# EAGLE schematic MOSFET_Board (EAGLE 9.3.0)

## Sheet 1 of 4
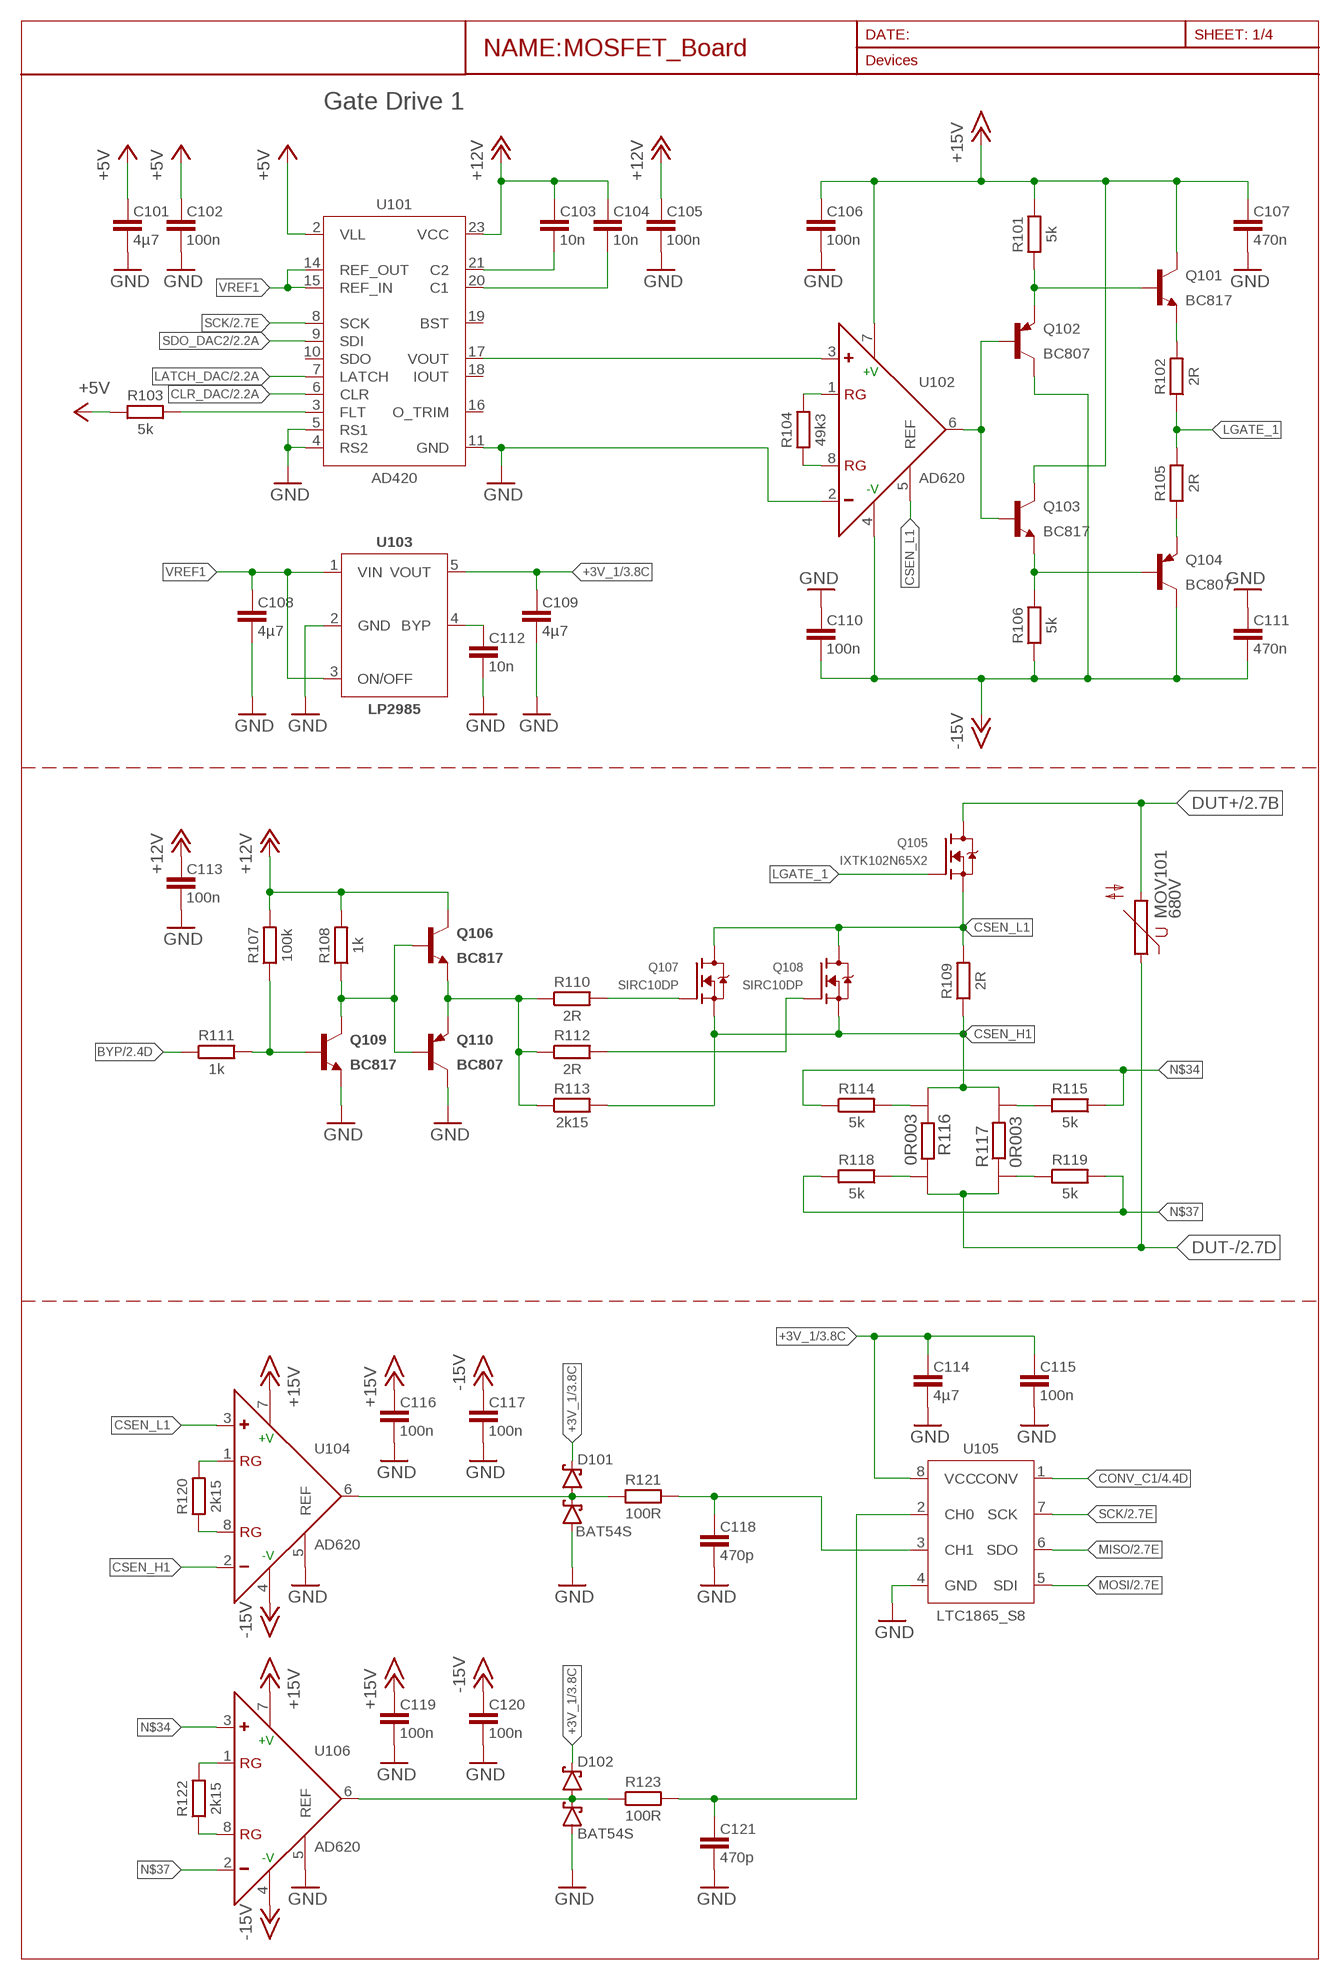
[diagram p0: schematic, sheet 1]

### Parts
C101  4µ7  CAP-3216  [CAPC3216X135]
C102  100n  CAP-1608  [CAPC1508X45]
C103  10n  CAP-1608  [CAPC1508X45]
C104  10n  CAP-1608  [CAPC1508X45]
C105  100n  CAP-1608  [CAPC1508X45]
C106  100n  CAP-1608  [CAPC1508X45]
C107  470n  CAP-1608  [CAPC1508X45]
C108  4µ7  CAP-3216  [CAPC3216X135]
C109  4µ7  CAP-3216  [CAPC3216X135]
C110  100n  CAP-1608  [CAPC1508X45]
C111  470n  CAP-1608  [CAPC1508X45]
C112  10n  CAP-1608  [CAPC1508X45]
C113  100n  CAP-1608  [CAPC1508X45]
C114  4µ7  CAP-3216  [CAPC3216X135]
C115  100n  CAP-1608  [CAPC1508X45]
C116  100n  CAP-1608  [CAPC1508X45]
C117  100n  CAP-1608  [CAPC1508X45]
C118  470p  CAP-1608  [CAPC1508X45]
C119  100n  CAP-1608  [CAPC1508X45]
C120  100n  CAP-1608  [CAPC1508X45]
C121  470p  CAP-1608  [CAPC1508X45]
D101  BAT54S  [SOT95P230X110-3]
D102  BAT54S  [SOT95P230X110-3]
MOV101  680V  MOV-14X7.4  [S14K680]
Q101  BC817  [SOT95P240X110-3]
Q102  BC807  [SOT95P240X110-3]
Q103  BC817  [SOT95P240X110-3]
Q104  BC807  [SOT95P240X110-3]
Q105  IXTK102N65X2  [TO-264P-V]
Q106  BC817  [SOT95P240X110-3]
Q107  SIRC10DP  [POWERPAK-SO-8]
Q108  SIRC10DP  [POWERPAK-SO-8]
Q109  BC817  [SOT95P240X110-3]
Q110  BC807  [SOT95P240X110-3]
R101  5k  R-EU-1608  [RESC1608X70]
R102  2R  R-EU-3216  [RESC3216X71]
R103  5k  R-EU-1608  [RESC1608X70]
R104  49k3  R-EU-1608  [RESC1608X70]
R105  2R  R-EU-3216  [RESC3216X71]
R106  5k  R-EU-1608  [RESC1608X70]
R107  100k  R-EU-1608  [RESC1608X70]
R108  1k  R-EU-1608  [RESC1608X70]
R109  2R  R-EU-3216  [RESC3216X71]
R110  2R  R-EU-3216  [RESC3216X71]
R111  1k  R-EU-1608  [RESC1608X70]
R112  2R  R-EU-3216  [RESC3216X71]
R113  2k15  R-EU-2012  [RESC2012X65]
R114  5k  R-EU-1608  [RESC1608X70]
R115  5k  R-EU-1608  [RESC1608X70]
R116  0R003  WSL3637_0.01  [WSL3637_0.01]
R117  0R003  WSL3637_0.01  [WSL3637_0.01]
R118  5k  R-EU-1608  [RESC1608X70]
R119  5k  R-EU-1608  [RESC1608X70]
R120  2k15  R-EU-2012  [RESC2012X65]
R121  100R  R-EU-1608  [RESC1608X70]
R122  2k15  R-EU-2012  [RESC2012X65]
R123  100R  R-EU-1608  [RESC1608X70]
U101  AD420  AD420AR  [SOIC127P1032X265-24]
U102  AD620  AD620R-8  [SOIC127P599X175-8]
U103  LP2985  [SOT95P280X145-5]
U104  AD620  AD620R-8  [SOIC127P599X175-8]
U105  LTC1865_S8  [SOIC127P599X175-8]
U106  AD620  AD620R-8  [SOIC127P599X175-8]

### Nets
+3V_1: C109.1 C114.1 C115.1 D101.2(C2) D102.2(C2) U103.5(VOUT) U105.8(VCC) ; also sheet 3
+5V: C101.1 C102.1 R103.2 U101.2(VLL) ; also sheet 2,3,4
+12V: C103.1 C104.1 C105.1 C113.1 Q106.3(C) R107.2 R108.2 U101.23(VCC) ; also sheet 2,3
+15V: C106.1 C107.1 C116.1 C119.1 Q101.3(C) Q103.3(C) R101.2 U102.7(+V) U104.7(+V) U106.7(+V) ; also sheet 2,3
-15V: C110.2 C111.2 C117.1 C120.1 Q102.3(C) Q104.3(C) R106.1 U102.4(-V) U104.4(-V) U106.4(-V) ; also sheet 2,3
BPY1G1: Q107.4(G) R110.2
BYP: R111.1 ; also sheet 2,4
BYP1: Q106.2(E) Q110.2(E) R110.1 R112.1 R113.1
BYP1G2: Q108.4(G) R112.2
CLR_DAC: U101.6(CLR) ; also sheet 2,4
CONV_C1: U105.1(CONV) ; also sheet 4
CSEN_H1: Q107.1(S) Q107.2(S) Q107.3(S) Q108.1(S) Q108.2(S) Q108.3(S) R109.1 R113.2 R116.I1 R117.I2 U104.2(-)
CSEN_L1: Q105.3(S) Q107.5(D) Q107.6(D) Q107.7(D) Q107.8(D) Q108.5(D) Q108.6(D) Q108.7(D) Q108.8(D) R109.2 U102.5(REF) U104.3(+)
DUT+ [DUT+]: MOV101.2 Q105.2(D) ; also sheet 2
DUT- [DUT-]: MOV101.1 R116.I2 R117.I1 ; also sheet 2,3
GND: C101.2 C102.2 C105.2 C106.2 C107.2 C108.2 C109.2 C110.1 C111.1 C112.2 C113.2 C114.2 C115.2 C116.2 C117.2 C118.2 C119.2 C120.2 C121.2 D101.1(A1) D102.1(A1) Q109.2(E) Q110.3(C) U101.4(RS2) U101.5(RS1) U101.11(GND) U102.2(-) U103.2(GND) U104.5(REF) U105.4(GND) U106.5(REF) ; also sheet 2,3,4
HIGHC1: C121.1 R123.2 U105.2(CH0)
LATCH_DAC: U101.7(LATCH) ; also sheet 2,4
LGATE_1: Q105.1(G) R102.1 R105.2
LOWC1: C118.1 R121.2 U105.3(CH1)
MISO: U105.6(SDO) ; also sheet 2,3,4
MOSI: U105.5(SDI) ; also sheet 2,3,4
N$1: Q101.1(B) Q102.2(E) R101.1
N$2: R104.2 U102.1(RG)
N$3: C103.2 U101.21(C2)
N$4: C104.2 U101.20(C1)
N$5: Q106.1(B) Q109.3(C) Q110.1(B) R108.1
N$6: R104.1 U102.8(RG)
N$7: D102.3(C1A2) R123.1 U106.6(OUT)
N$8: Q109.1(B) R107.1 R111.2
N$9: U101.17(VOUT) U102.3(+)
N$10: C112.1 U103.4(BYP)
N$11: Q104.2(E) R105.1
N$13: Q101.2(E) R102.2
N$16: D101.3(C1A2) R121.1 U104.6(OUT)
N$32: R115.2 R117.E2
N$34: R114.1 R115.1 U106.3(+)
N$35 [DUT-]: R116.E2 R118.1
N$37: R118.2 R119.2 U106.2(-)
N$38: R117.E1 R119.1
N$40: R114.2 R116.E1
N$60: R103.1 U101.3(FLT)
N$67: Q102.1(B) Q103.1(B) U102.6(OUT)
N$68: Q103.2(E) Q104.1(B) R106.2
RG1_L3: R122.2 U106.1(RG)
RG1_L4: R120.2 U104.1(RG)
RG2_L3: R122.1 U106.8(RG)
RG2_L4: R120.1 U104.8(RG)
SCK: U101.8(SCK) U105.7(SCK) ; also sheet 2,3,4
SDO_DAC2: U101.9(SDI) ; also sheet 2
VREF1: C108.1 U101.14(REF_OUT) U101.15(REF_IN) U103.1(VIN) U103.3(ON/OFF)
Unconnected: U101.10(SDO) U101.16(O_TRIM) U101.18(IOUT) U101.19(BST)

### Notes on the sheet
- Gate Drive 1

## Sheet 2 of 4
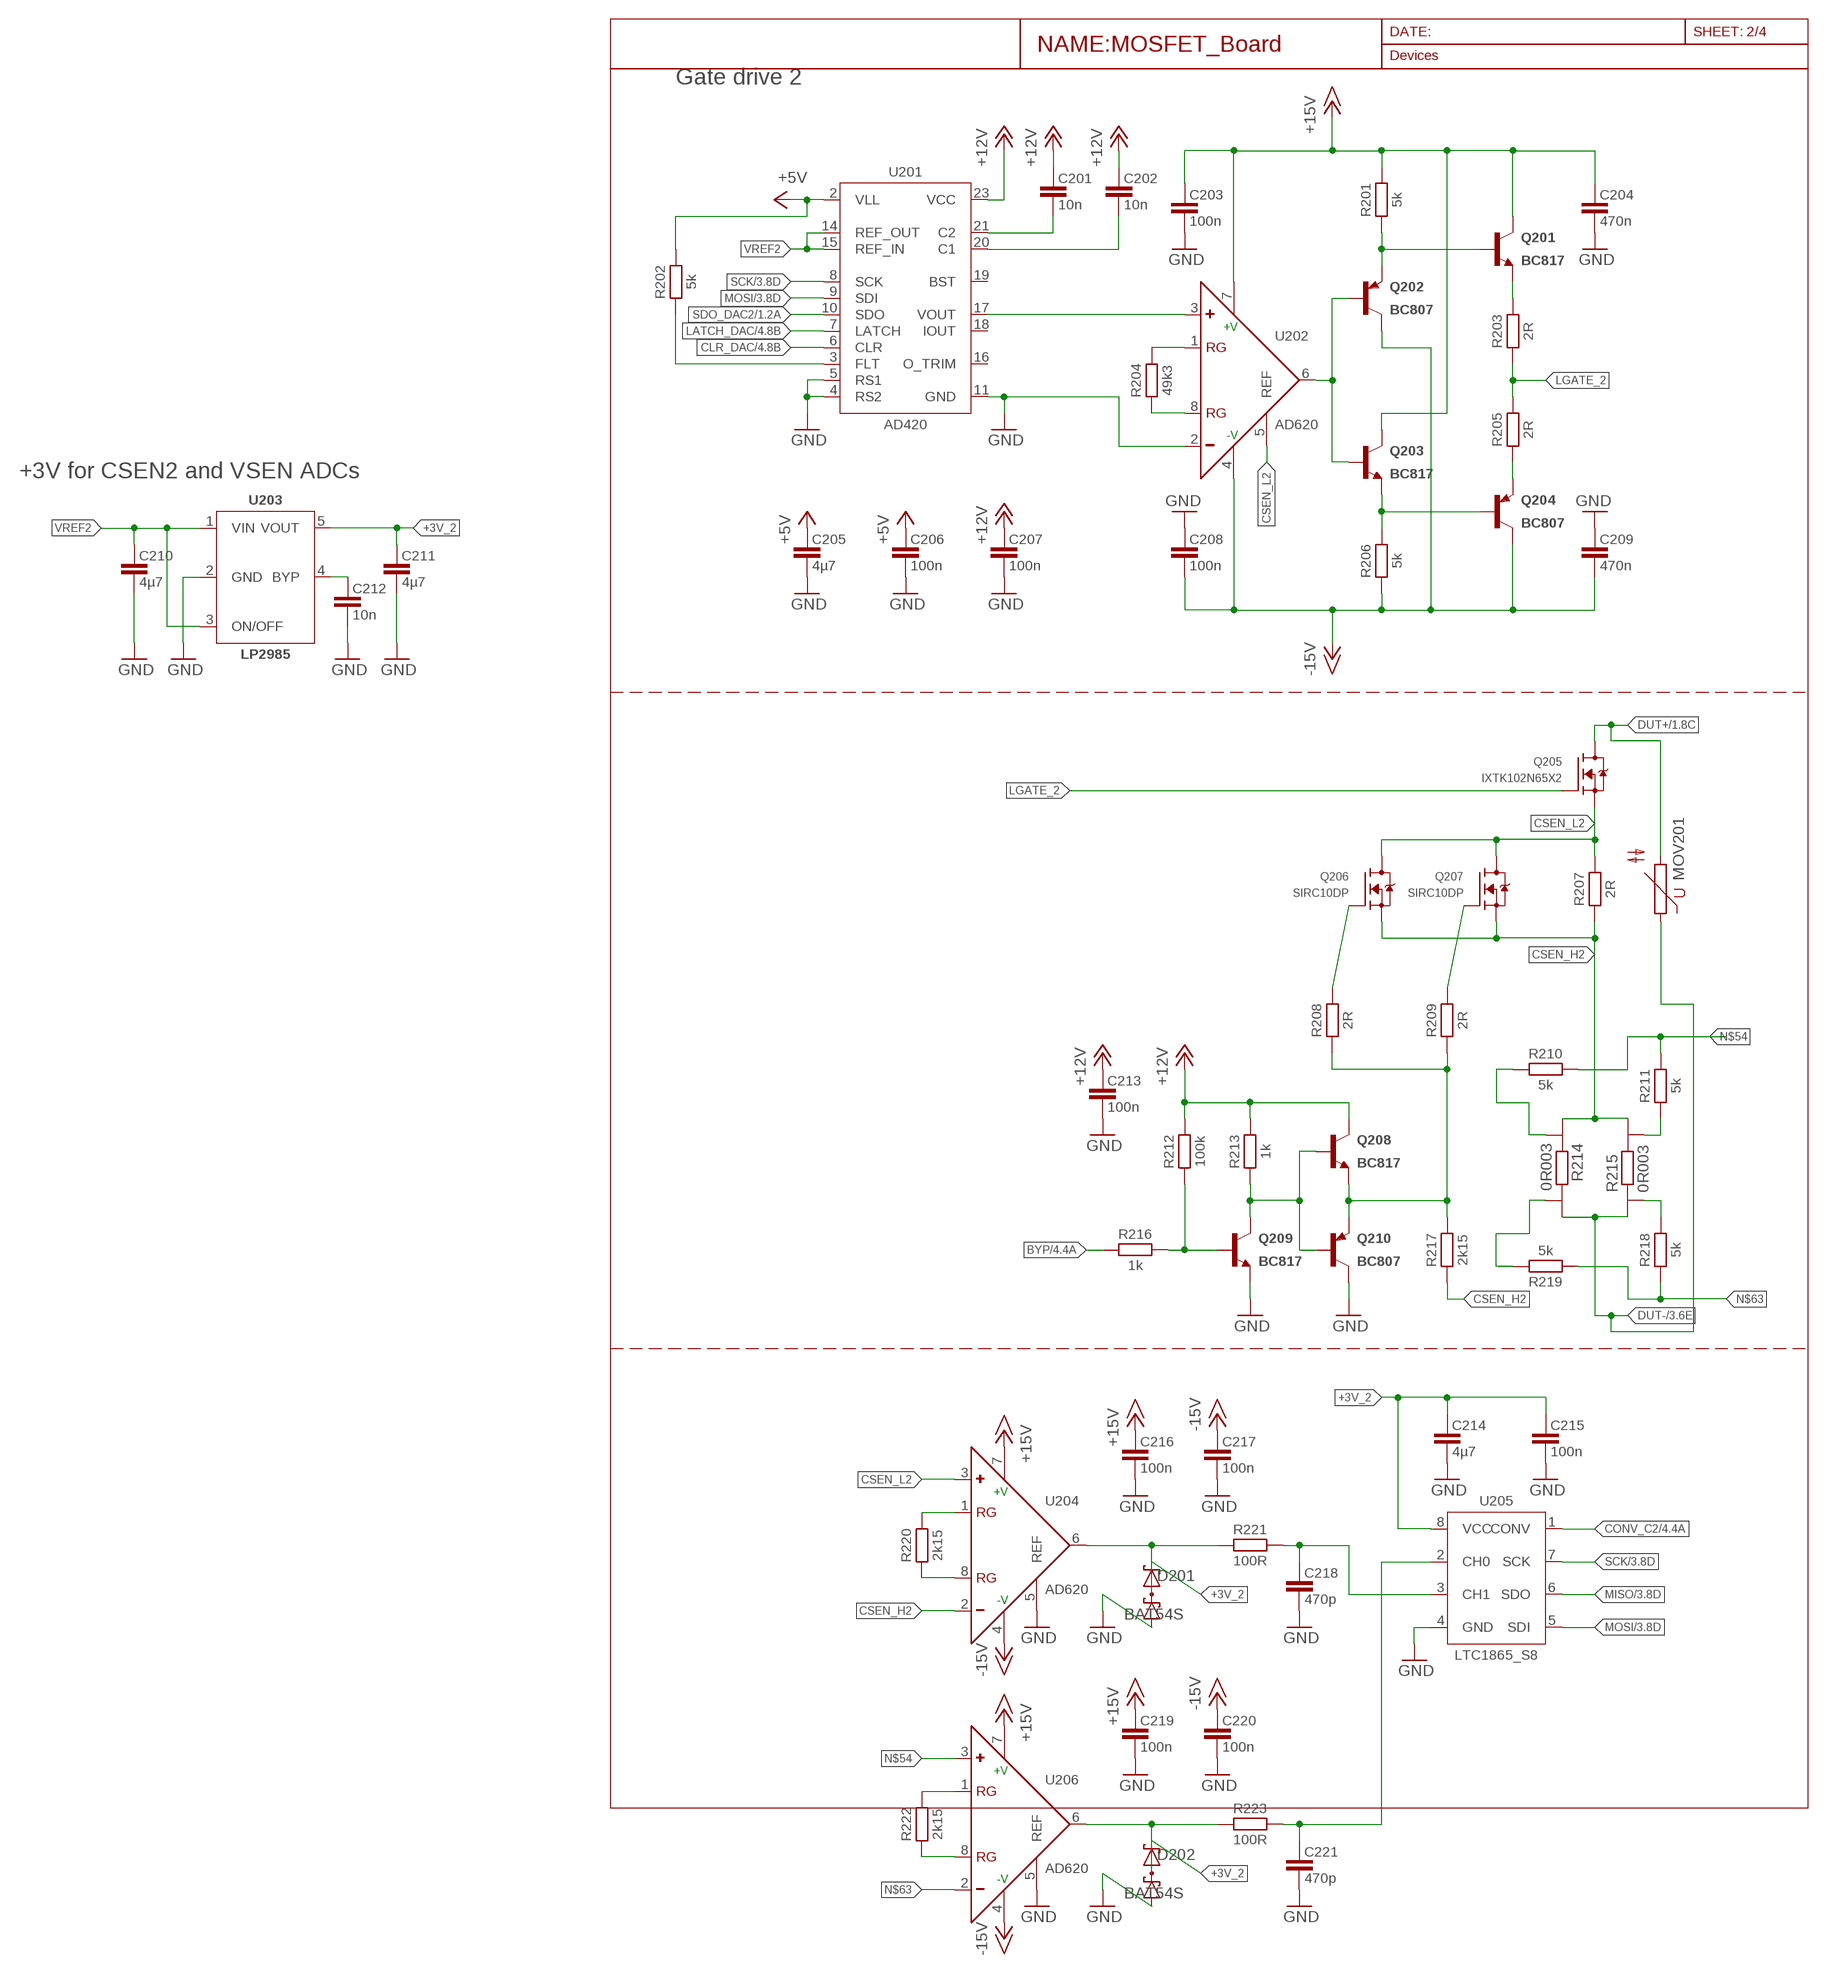
[diagram p1: schematic, sheet 2]

### Parts
C201  10n  CAP-1608  [CAPC1508X45]
C202  10n  CAP-1608  [CAPC1508X45]
C203  100n  CAP-1608  [CAPC1508X45]
C204  470n  CAP-1608  [CAPC1508X45]
C205  4µ7  CAP-3216  [CAPC3216X135]
C206  100n  CAP-1608  [CAPC1508X45]
C207  100n  CAP-1608  [CAPC1508X45]
C208  100n  CAP-1608  [CAPC1508X45]
C209  470n  CAP-1608  [CAPC1508X45]
C210  4µ7  CAP-3216  [CAPC3216X135]
C211  4µ7  CAP-3216  [CAPC3216X135]
C212  10n  CAP-1608  [CAPC1508X45]
C213  100n  CAP-1608  [CAPC1508X45]
C214  4µ7  CAP-3216  [CAPC3216X135]
C215  100n  CAP-1608  [CAPC1508X45]
C216  100n  CAP-1608  [CAPC1508X45]
C217  100n  CAP-1608  [CAPC1508X45]
C218  470p  CAP-1608  [CAPC1508X45]
C219  100n  CAP-1608  [CAPC1508X45]
C220  100n  CAP-1608  [CAPC1508X45]
C221  470p  CAP-1608  [CAPC1508X45]
D201  BAT54S  [SOT95P230X110-3]
D202  BAT54S  [SOT95P230X110-3]
MOV201  MOV-14X7.4  [S14K680]
Q201  BC817  [SOT95P240X110-3]
Q202  BC807  [SOT95P240X110-3]
Q203  BC817  [SOT95P240X110-3]
Q204  BC807  [SOT95P240X110-3]
Q205  IXTK102N65X2  [TO-264P-V]
Q206  SIRC10DP  [POWERPAK-SO-8]
Q207  SIRC10DP  [POWERPAK-SO-8]
Q208  BC817  [SOT95P240X110-3]
Q209  BC817  [SOT95P240X110-3]
Q210  BC807  [SOT95P240X110-3]
R201  5k  R-EU-1608  [RESC1608X70]
R202  5k  R-EU-1608  [RESC1608X70]
R203  2R  R-EU-3216  [RESC3216X71]
R204  49k3  R-EU-1608  [RESC1608X70]
R205  2R  R-EU-3216  [RESC3216X71]
R206  5k  R-EU-1608  [RESC1608X70]
R207  2R  R-EU-3216  [RESC3216X71]
R208  2R  R-EU-3216  [RESC3216X71]
R209  2R  R-EU-3216  [RESC3216X71]
R210  5k  R-EU-1608  [RESC1608X70]
R211  5k  R-EU-1608  [RESC1608X70]
R212  100k  R-EU-1608  [RESC1608X70]
R213  1k  R-EU-1608  [RESC1608X70]
R214  0R003  WSL3637_0.01  [WSL3637_0.01]
R215  0R003  WSL3637_0.01  [WSL3637_0.01]
R216  1k  R-EU-1608  [RESC1608X70]
R217  2k15  R-EU-2012  [RESC2012X65]
R218  5k  R-EU-1608  [RESC1608X70]
R219  5k  R-EU-1608  [RESC1608X70]
R220  2k15  R-EU-2012  [RESC2012X65]
R221  100R  R-EU-1608  [RESC1608X70]
R222  2k15  R-EU-2012  [RESC2012X65]
R223  100R  R-EU-1608  [RESC1608X70]
U201  AD420  AD420AR  [SOIC127P1032X265-24]
U202  AD620  AD620R-8  [SOIC127P599X175-8]
U203  LP2985  [SOT95P280X145-5]
U204  AD620  AD620R-8  [SOIC127P599X175-8]
U205  LTC1865_S8  [SOIC127P599X175-8]
U206  AD620  AD620R-8  [SOIC127P599X175-8]

### Nets
+3V_2: C211.1 C214.1 C215.1 D201.2(C2) D202.2(C2) U203.5(VOUT) U205.8(VCC)
+5V: C205.1 C206.1 R202.2 U201.2(VLL) ; also sheet 1,3,4
+12V: C201.1 C202.1 C207.1 C213.1 Q208.3(C) R212.2 R213.2 U201.23(VCC) ; also sheet 1,3
+15V: C203.1 C204.1 C216.1 C219.1 Q201.3(C) Q203.3(C) R201.2 U202.7(+V) U204.7(+V) U206.7(+V) ; also sheet 1,3
-15V: C208.2 C209.2 C217.1 C220.1 Q202.3(C) Q204.3(C) R206.1 U202.4(-V) U204.4(-V) U206.4(-V) ; also sheet 1,3
BYP: R216.1 ; also sheet 1,4
BYP2: Q208.2(E) Q210.2(E) R208.1 R209.1 R217.2
BYP2G1: Q206.4(G) R208.2
BYP2G2: Q207.4(G) R209.2
CLR_DAC: U201.6(CLR) ; also sheet 1,4
CONV_C2: U205.1(CONV) ; also sheet 4
CSEN_H2: Q206.1(S) Q206.2(S) Q206.3(S) Q207.1(S) Q207.2(S) Q207.3(S) R207.1 R214.I1 R215.I2 R217.1 U204.2(-)
CSEN_L2: Q205.3(S) Q206.5(D) Q206.6(D) Q206.7(D) Q206.8(D) Q207.5(D) Q207.6(D) Q207.7(D) Q207.8(D) R207.2 U202.5(REF) U204.3(+)
DUT+ [DUT+]: MOV201.2 Q205.2(D) ; also sheet 1
DUT- [DUT-]: MOV201.1 R214.I2 R215.I1 ; also sheet 1,3
GND: C203.2 C204.2 C205.2 C206.2 C207.2 C208.1 C209.1 C210.2 C211.2 C212.2 C213.2 C214.2 C215.2 C216.2 C217.2 C218.2 C219.2 C220.2 C221.2 D201.1(A1) D202.1(A1) Q209.2(E) Q210.3(C) U201.4(RS2) U201.5(RS1) U201.11(GND) U202.2(-) U203.2(GND) U204.5(REF) U205.4(GND) U206.5(REF) ; also sheet 1,3,4
HIGHC2: C221.1 R223.2 U205.2(CH0)
LATCH_DAC: U201.7(LATCH) ; also sheet 1,4
LGATE_2: Q205.1(G) R203.1 R205.2
LOWC2: C218.1 R221.2 U205.3(CH1)
MISO: U205.6(SDO) ; also sheet 1,3,4
MOSI: U201.9(SDI) U205.5(SDI) ; also sheet 1,3,4
N$12: Q201.1(B) Q202.2(E) R201.1
N$14: Q204.2(E) R205.1
N$15: Q201.2(E) R203.2
N$25: Q208.1(B) Q209.3(C) Q210.1(B) R213.1
N$31: Q209.1(B) R212.1 R216.2
N$39: R210.1 R214.E1
N$41: C201.2 U201.21(C2)
N$42: C202.2 U201.20(C1)
N$43: Q202.1(B) Q203.1(B) U202.6(OUT)
N$44: Q203.2(E) Q204.1(B) R206.2
N$45: R202.1 U201.3(FLT)
N$46: R211.1 R215.E2
N$49: R204.2 U202.1(RG)
N$50: R204.1 U202.8(RG)
N$51: U201.17(VOUT) U202.3(+)
N$52 [DUT-]: R215.E1 R218.2
N$53 [DUT-]: R214.E2 R219.2
N$54: R210.2 R211.2 U206.3(+)
N$56: D202.3(C1A2) R223.1 U206.6(OUT)
N$57: D201.3(C1A2) R221.1 U204.6(OUT)
N$62: C212.1 U203.4(BYP)
N$63: R218.1 R219.1 U206.2(-)
RG1_L1: R222.2 U206.1(RG)
RG1_L2: R220.2 U204.1(RG)
RG2_L1: R222.1 U206.8(RG)
RG2_L2: R220.1 U204.8(RG)
SCK: U201.8(SCK) U205.7(SCK) ; also sheet 1,3,4
SDO_DAC2: U201.10(SDO) ; also sheet 1
VREF2: C210.1 U201.14(REF_OUT) U201.15(REF_IN) U203.1(VIN) U203.3(ON/OFF)
Unconnected: U201.16(O_TRIM) U201.18(IOUT) U201.19(BST)

### Notes on the sheet
- Gate drive 2
- +3V for CSEN2 and VSEN ADCs

## Sheet 3 of 4
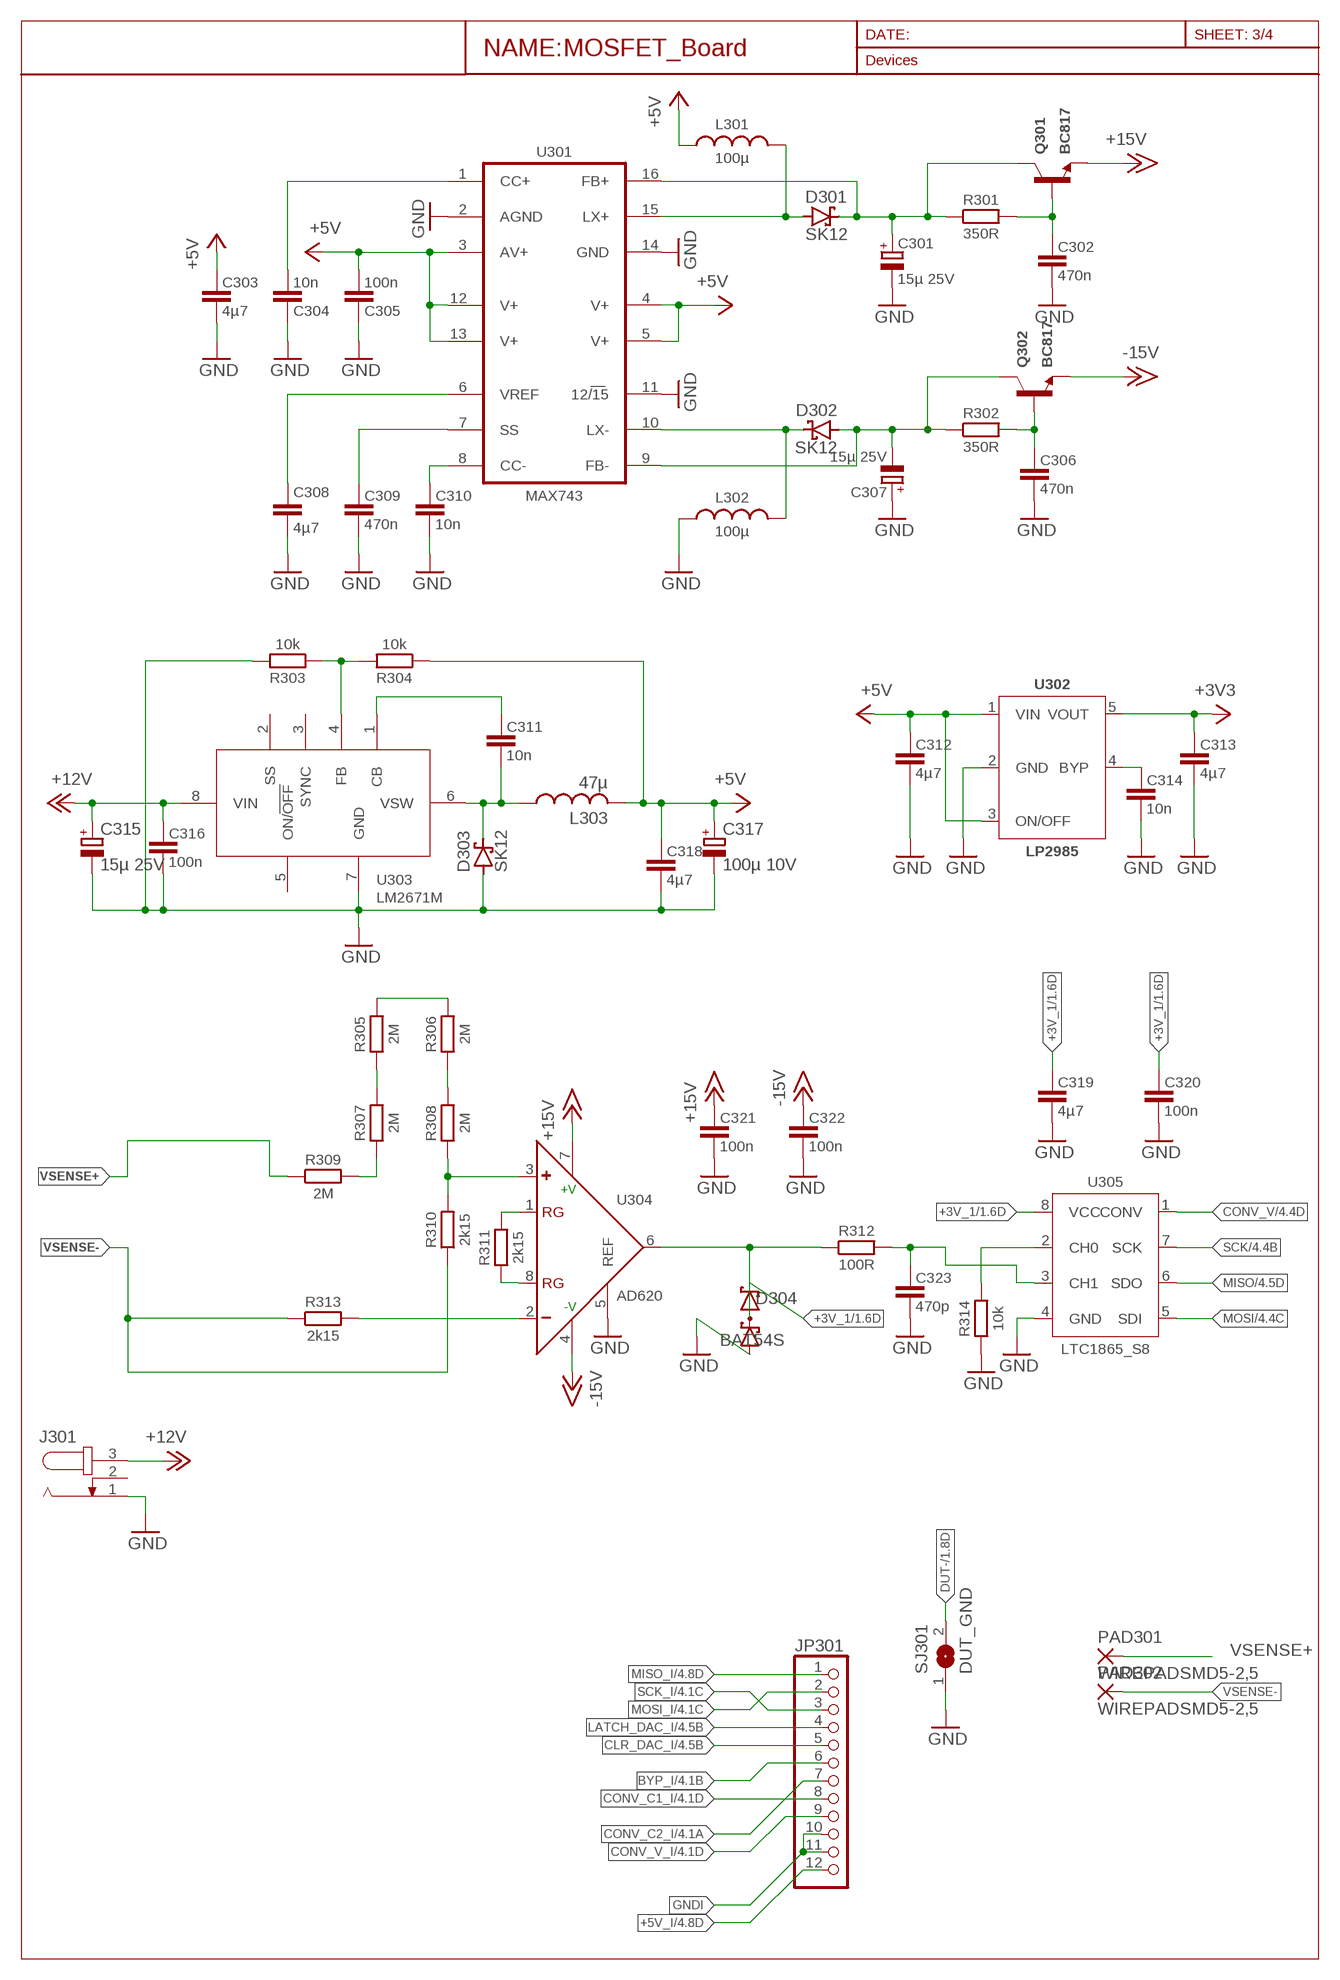
[diagram p2: schematic, sheet 3]

### Parts
C301  15µ 25V  CAP-POL7343  [CAPCP7343X310]
C302  470n  CAP-1608  [CAPC1508X45]
C303  4µ7  CAP-3216  [CAPC3216X135]
C304  10n  CAP-1608  [CAPC1508X45]
C305  100n  CAP-1608  [CAPC1508X45]
C306  470n  CAP-1608  [CAPC1508X45]
C307  15µ 25V  CAP-POL7343  [CAPCP7343X310]
C308  4µ7  CAP-3216  [CAPC3216X135]
C309  470n  CAP-1608  [CAPC1508X45]
C310  10n  CAP-1608  [CAPC1508X45]
C311  10n  CAP-1608  [CAPC1508X45]
C312  4µ7  CAP-3216  [CAPC3216X135]
C313  4µ7  CAP-3216  [CAPC3216X135]
C314  10n  CAP-1608  [CAPC1508X45]
C315  15µ 25V  CAP-POL7343  [CAPCP7343X310]
C316  100n  CAP-1608  [CAPC1508X45]
C317  100µ 10V  CAP-POL7343  [CAPCP7343X310]
C318  4µ7  CAP-3216  [CAPC3216X135]
C319  4µ7  CAP-3216  [CAPC3216X135]
C320  100n  CAP-1608  [CAPC1508X45]
C321  100n  CAP-1608  [CAPC1508X45]
C322  100n  CAP-1608  [CAPC1508X45]
C323  470p  CAP-1608  [CAPC1508X45]
D301  SK12  [DIOM4336X262]
D302  SK12  [DIOM4336X262]
D303  SK12  [DIOM4336X262]
D304  BAT54S  [SOT95P230X110-3]
J301  JACK-PLUG-2.5  [SPC4078]
JP301  PINHD-1X12  [1X12]
L301  100µ  SRN5040  [SRN5040]
L302  100µ  SRN5040  [SRN5040]
L303  47µ  SRN5040  [SRN5040]
PAD301  WIREPADSMD5-2,5  [5-2,5]
PAD302  WIREPADSMD5-2,5  [5-2,5]
Q301  BC817  [SOT95P240X110-3]
Q302  BC817  [SOT95P240X110-3]
R301  350R  R-EU-1608  [RESC1608X70]
R302  350R  R-EU-1608  [RESC1608X70]
R303  10k  R-EU-1608  [RESC1608X70]
R304  10k  R-EU-1608  [RESC1608X70]
R305  2M  R-EU-3216  [RESC3216X71]
R306  2M  R-EU-3216  [RESC3216X71]
R307  2M  R-EU-3216  [RESC3216X71]
R308  2M  R-EU-3216  [RESC3216X71]
R309  2M  R-EU-3216  [RESC3216X71]
R310  2k15  R-EU-2012  [RESC2012X65]
R311  2k15  R-EU-2012  [RESC2012X65]
R312  100R  R-EU-1608  [RESC1608X70]
R313  2k15  R-EU-2012  [RESC2012X65]
R314  10k  R-EU-1608  [RESC1608X70]
SJ301  DUT_GND  SJW  [SJW]
U301  MAX743  MAX743W  [SOIC127P1032X265-16]
U302  LP2985  [SOT95P280X145-5]
U303  LM2671M  [SOIC127P599X175-8]
U304  AD620  AD620R-8  [SOIC127P599X175-8]
U305  LTC1865_S8  [SOIC127P599X175-8]

### Nets
+3V3: C313.1 U302.5(VOUT) ; also sheet 4
+3V_1: C319.1 C320.1 D304.2(C2) U305.8(VCC) ; also sheet 1
+5V: C303.1 C305.2 C312.1 C317.1(+) C318.1 L301.1 L303.2 R304.1 U301.3(AV+) U301.4(V+) U301.5(V+) U301.12(V+) U301.13(V+) U302.1(VIN) U302.3(ON/OFF) ; also sheet 1,2,4
+5V_I [default_iso]: JP301.12 ; also sheet 4
+12V: C315.1(+) C316.1 J301.3 U303.8(VIN) ; also sheet 1,2
+15V: C321.1 Q301.2(E) U304.7(+V) ; also sheet 1,2
-15V: C322.1 Q302.2(E) U304.4(-V) ; also sheet 1,2
BYP_I [default_iso]: JP301.6 ; also sheet 4
CLR_DAC_I [default_iso]: JP301.5 ; also sheet 4
CONV_C1_I [default_iso]: JP301.8 ; also sheet 4
CONV_C2_I [default_iso]: JP301.7 ; also sheet 4
CONV_V: U305.1(CONV) ; also sheet 4
CONV_V_I [default_iso]: JP301.9 ; also sheet 4
DUT- [DUT-]: SJ301.2 ; also sheet 1,2
GND: C301.2(-) C302.2 C303.2 C304.1 C305.1 C306.2 C307.1(+) C308.2 C309.2 C310.2 C312.2 C313.2 C314.2 C315.2(-) C316.2 C317.2(-) C318.2 C319.2 C320.2 C321.2 C322.2 C323.2 D303.2(A) D304.1(A1) J301.1 L302.2 R303.2 R314.1 SJ301.1 U301.2(AGND) U301.11(12/15) U301.14(GND) U302.2(GND) U303.7(GND) U304.5(REF) U305.4(GND) ; also sheet 1,2,4
GNDI [default_iso]: JP301.10 JP301.11 ; also sheet 4
LATCH_DAC_I [default_iso]: JP301.4 ; also sheet 4
MISO: U305.6(SDO) ; also sheet 1,2,4
MISO_I [default_iso]: JP301.1 ; also sheet 4
MOSI: U305.5(SDI) ; also sheet 1,2,4
MOSI_I [default_iso]: JP301.2 ; also sheet 4
N$17: C311.1 U303.1(CB)
N$19: C311.2 D303.1(C) L303.1 U303.6(VSW)
N$20: R303.1 R304.2 U303.4(FB)
N$23: D304.3(C1A2) R312.1 U304.6(OUT)
N$24: R306.1 R308.2
N$26: R305.2 R306.2
N$27: R305.1 R307.2
N$28: R314.2 U305.2(CH0)
N$29: R308.1 R310.2 U304.3(+)
N$30: C323.1 R312.2 U305.3(CH1)
N$33: R307.1 R309.2
N$36: R313.2 U304.2(-)
N$55: C310.1 U301.8(CC-)
N$61: C309.1 U301.7(SS)
N$64: C304.2 U301.1(CC+)
N$65: D301.2(A) L301.2 U301.15(LX+)
N$66: C314.1 U302.4(BYP)
N$69: D302.1(C) L302.1 U301.10(LX-)
N$70: C301.1(+) D301.1(C) Q301.3(C) R301.1 U301.16(FB+)
N$71: C302.1 Q301.1(B) R301.2
N$72: C307.2(-) D302.2(A) Q302.3(C) R302.1 U301.9(FB-)
N$73: C306.1 Q302.1(B) R302.2
RG1_H6: R311.2 U304.1(RG)
RG2_H6: R311.1 U304.8(RG)
SCK: U305.7(SCK) ; also sheet 1,2,4
SCK_I [default_iso]: JP301.3 ; also sheet 4
VREF_MAX743: C308.1 U301.6(VREF)
VSENSE+ [VSENSE+]: PAD301.1(P) R309.1
VSENSE- [VSENSE-]: PAD302.1(P) R310.1 R313.1
Unconnected: J301.2 U303.2(SS) U303.3(SYNC) U303.5(ON/!OFF)

## Sheet 4 of 4
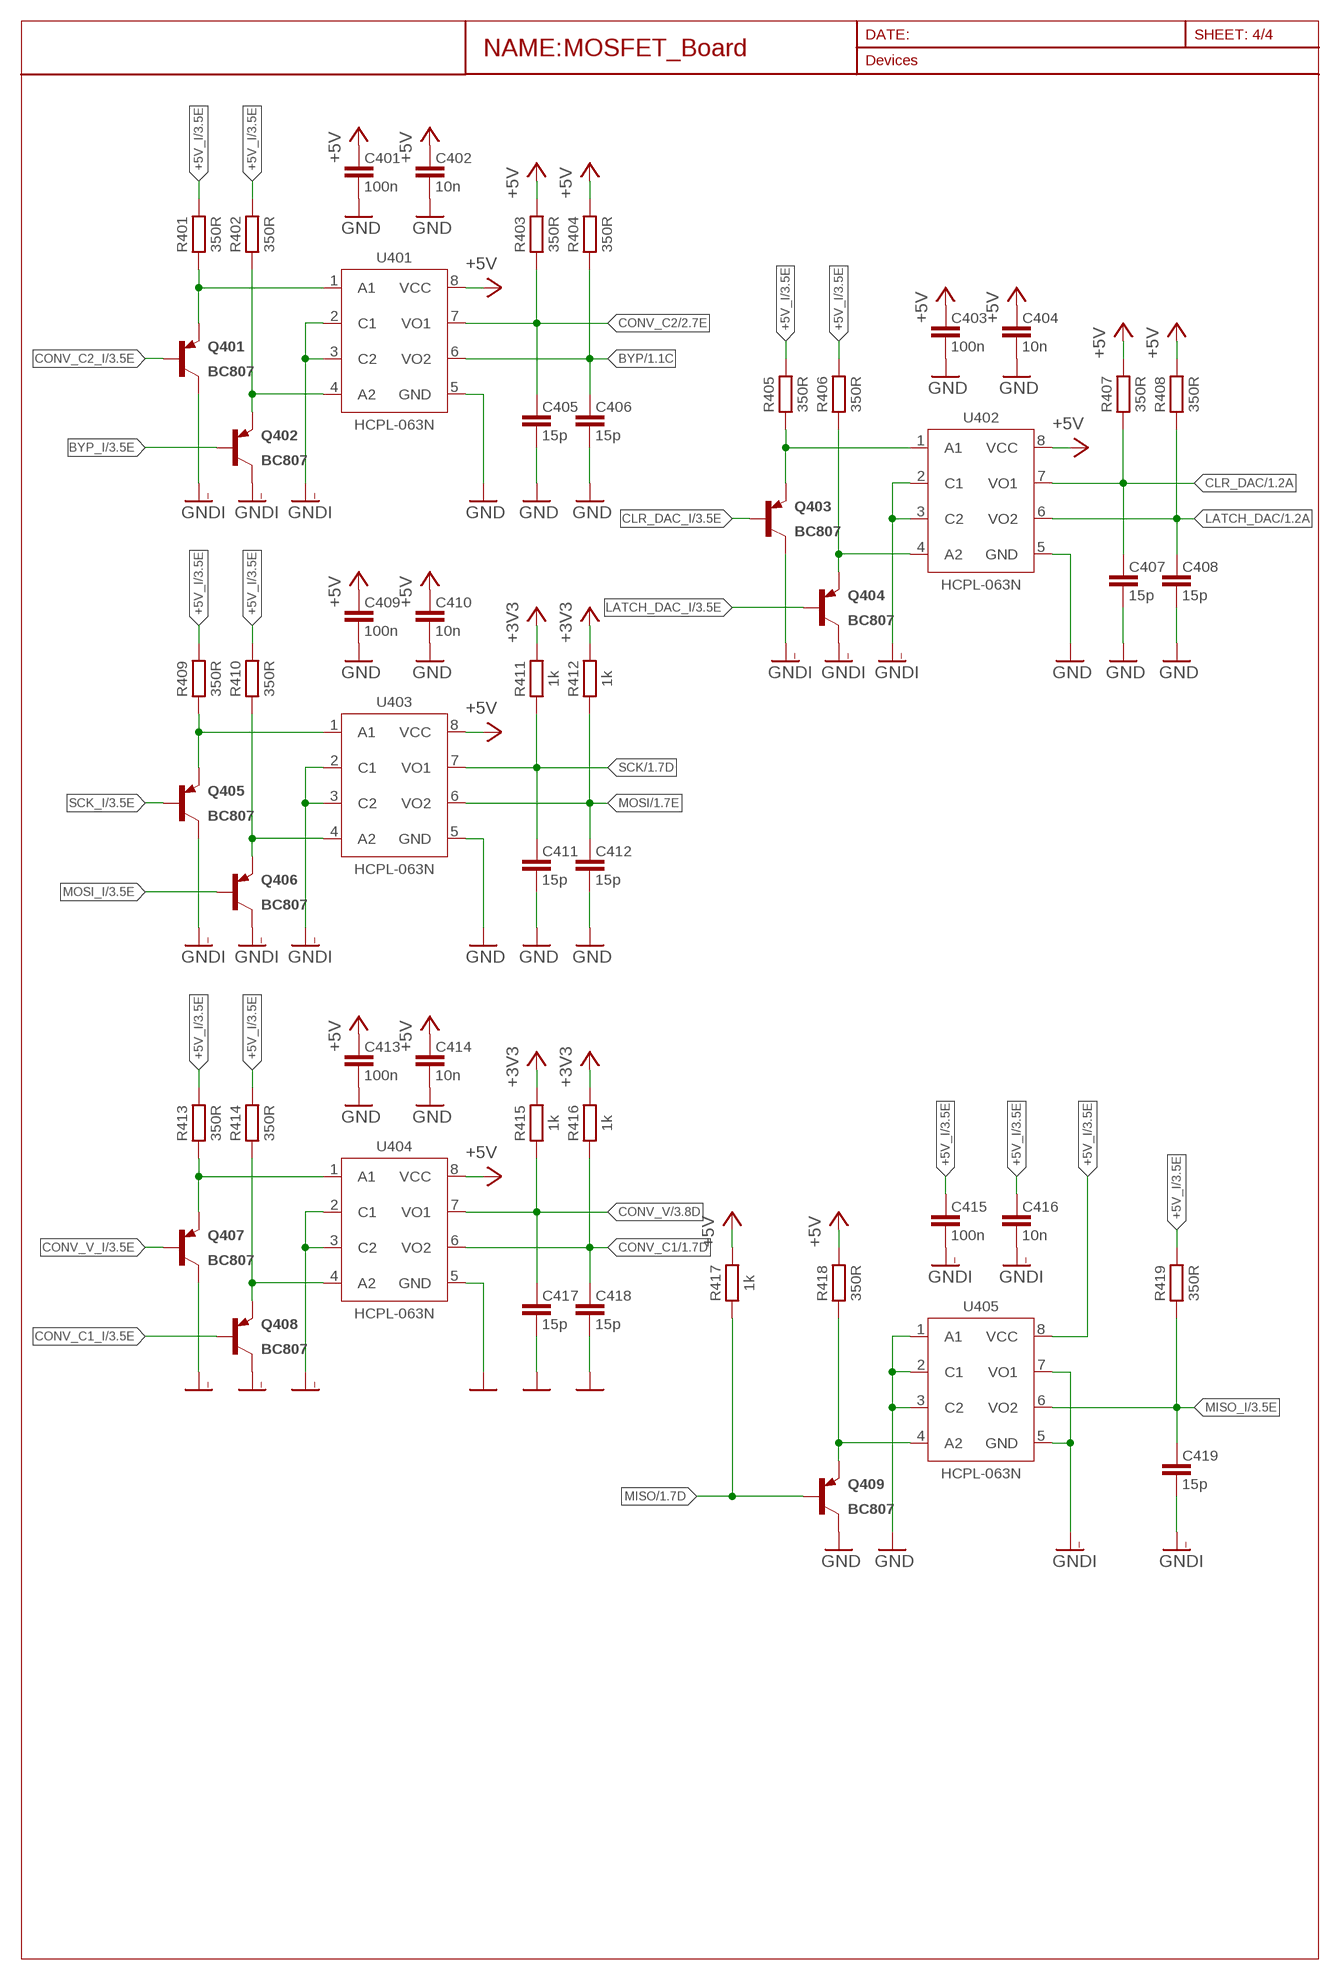
[diagram p3: schematic, sheet 4]

### Parts
C401  100n  CAP-1608  [CAPC1508X45]
C402  10n  CAP-1608  [CAPC1508X45]
C403  100n  CAP-1608  [CAPC1508X45]
C404  10n  CAP-1608  [CAPC1508X45]
C405  15p  CAP-1608  [CAPC1508X45]
C406  15p  CAP-1608  [CAPC1508X45]
C407  15p  CAP-1608  [CAPC1508X45]
C408  15p  CAP-1608  [CAPC1508X45]
C409  100n  CAP-1608  [CAPC1508X45]
C410  10n  CAP-1608  [CAPC1508X45]
C411  15p  CAP-1608  [CAPC1508X45]
C412  15p  CAP-1608  [CAPC1508X45]
C413  100n  CAP-1608  [CAPC1508X45]
C414  10n  CAP-1608  [CAPC1508X45]
C415  100n  CAP-1608  [CAPC1508X45]
C416  10n  CAP-1608  [CAPC1508X45]
C417  15p  CAP-1608  [CAPC1508X45]
C418  15p  CAP-1608  [CAPC1508X45]
C419  15p  CAP-1608  [CAPC1508X45]
Q401  BC807  [SOT95P240X110-3]
Q402  BC807  [SOT95P240X110-3]
Q403  BC807  [SOT95P240X110-3]
Q404  BC807  [SOT95P240X110-3]
Q405  BC807  [SOT95P240X110-3]
Q406  BC807  [SOT95P240X110-3]
Q407  BC807  [SOT95P240X110-3]
Q408  BC807  [SOT95P240X110-3]
Q409  BC807  [SOT95P240X110-3]
R401  350R  R-EU-1608  [RESC1608X70]
R402  350R  R-EU-1608  [RESC1608X70]
R403  350R  R-EU-1608  [RESC1608X70]
R404  350R  R-EU-1608  [RESC1608X70]
R405  350R  R-EU-1608  [RESC1608X70]
R406  350R  R-EU-1608  [RESC1608X70]
R407  350R  R-EU-1608  [RESC1608X70]
R408  350R  R-EU-1608  [RESC1608X70]
R409  350R  R-EU-1608  [RESC1608X70]
R410  350R  R-EU-1608  [RESC1608X70]
R411  1k  R-EU-1608  [RESC1608X70]
R412  1k  R-EU-1608  [RESC1608X70]
R413  350R  R-EU-1608  [RESC1608X70]
R414  350R  R-EU-1608  [RESC1608X70]
R415  1k  R-EU-1608  [RESC1608X70]
R416  1k  R-EU-1608  [RESC1608X70]
R417  1k  R-EU-1608  [RESC1608X70]
R418  350R  R-EU-1608  [RESC1608X70]
R419  350R  R-EU-1608  [RESC1608X70]
U401  HCPL-063N  [SOIC127P599X175-8]
U402  HCPL-063N  [SOIC127P599X175-8]
U403  HCPL-063N  [SOIC127P599X175-8]
U404  HCPL-063N  [SOIC127P599X175-8]
U405  HCPL-063N  [SOIC127P599X175-8]

### Nets
+3V3: R411.2 R412.2 R415.2 R416.2 ; also sheet 3
+5V: C401.1 C402.1 C403.1 C404.1 C409.1 C410.1 C413.1 C414.1 R403.2 R404.2 R407.2 R408.2 R417.2 R418.2 U401.8(VCC) U402.8(VCC) U403.8(VCC) U404.8(VCC) ; also sheet 1,2,3
+5V_I [default_iso]: C415.1 C416.1 R401.2 R402.2 R405.2 R406.2 R409.2 R410.2 R413.2 R414.2 R419.2 U405.8(VCC) ; also sheet 3
BYP: C406.1 R404.1 U401.6(VO2) ; also sheet 1,2
BYP_I [default_iso]: Q402.1(B) ; also sheet 3
CLR_DAC: C407.1 R407.1 U402.7(VO1) ; also sheet 1,2
CLR_DAC_I [default_iso]: Q403.1(B) ; also sheet 3
CONV_C1: C418.1 R416.1 U404.6(VO2) ; also sheet 1
CONV_C1_I [default_iso]: Q408.1(B) ; also sheet 3
CONV_C2: C405.1 R403.1 U401.7(VO1) ; also sheet 2
CONV_C2_I [default_iso]: Q401.1(B) ; also sheet 3
CONV_V: C417.1 R415.1 U404.7(VO1) ; also sheet 3
CONV_V_I [default_iso]: Q407.1(B) ; also sheet 3
GND: C401.2 C402.2 C403.2 C404.2 C405.2 C406.2 C407.2 C408.2 C409.2 C410.2 C411.2 C412.2 C413.2 C414.2 C417.2 C418.2 Q409.3(C) U401.5(GND) U402.5(GND) U403.5(GND) U404.5(GND) U405.1(A1) U405.2(C1) U405.3(C2) ; also sheet 1,2,3
GNDI [default_iso]: C415.2 C416.2 C419.2 Q401.3(C) Q402.3(C) Q403.3(C) Q404.3(C) Q405.3(C) Q406.3(C) Q407.3(C) Q408.3(C) U401.2(C1) U401.3(C2) U402.2(C1) U402.3(C2) U403.2(C1) U403.3(C2) U404.2(C1) U404.3(C2) U405.5(GND) U405.7(VO1) ; also sheet 3
LATCH_DAC: C408.1 R408.1 U402.6(VO2) ; also sheet 1,2
LATCH_DAC_I [default_iso]: Q404.1(B) ; also sheet 3
MISO: Q409.1(B) R417.1 ; also sheet 1,2,3
MISO_I [default_iso]: C419.1 R419.1 U405.6(VO2) ; also sheet 3
MOSI: C412.1 R412.1 U403.6(VO2) ; also sheet 1,2,3
MOSI_I [default_iso]: Q406.1(B) ; also sheet 3
N$18: Q409.2(E) R418.1 U405.4(A2)
N$21 [default_iso]: Q405.2(E) R409.1 U403.1(A1)
N$22 [default_iso]: Q406.2(E) R410.1 U403.4(A2)
N$47 [default_iso]: Q401.2(E) R401.1 U401.1(A1)
N$48 [default_iso]: Q402.2(E) R402.1 U401.4(A2)
N$58 [default_iso]: Q403.2(E) R405.1 U402.1(A1)
N$59 [default_iso]: Q404.2(E) R406.1 U402.4(A2)
N$76 [default_iso]: Q407.2(E) R413.1 U404.1(A1)
N$77 [default_iso]: Q408.2(E) R414.1 U404.4(A2)
SCK: C411.1 R411.1 U403.7(VO1) ; also sheet 1,2,3
SCK_I [default_iso]: Q405.1(B) ; also sheet 3

## Library data of the parts
C101-C121 C201-C221 C302-C306 C308-C314 C316 C318-C323 C401-C419 = custom_capacitors:CAP
C301 C307 C315 C317 = custom_capacitors:CAP-POL
D101 D102 D201 D202 D304 = custom_semiconductors_discrete:BAT54
D301-D303 = custom_semiconductors_discrete:SK12
J301 = custom_mechanical:JACK-PLUG
JP301 = pinhead:PINHD-1X12: PIN HEADER
L301-L303 = custom_inductors:SRN5040
MOV101 MOV201 = custom_resistors:MOV
PAD301 PAD302 = wirepad:WIREPAD: Wire PAD connect wire on PCB
Q101 Q103 Q106 Q109 Q201 Q203 Q208 Q209 Q301 Q302 = custom_semiconductors_discrete:BC817
Q102 Q104 Q110 Q202 Q204 Q210 Q401-Q409 = custom_semiconductors_discrete:BC807
Q105 Q205 = custom_semiconductors_discrete:IXTK102N65X2
Q107 Q108 Q206 Q207 = custom_semiconductors_discrete:SIRC10DP
R101-R115 R118-R123 R201-R213 R216-R223 R301-R314 R401-R419 = custom_resistors:R-EU
R116 R117 R214 R215 = custom_resistors:WSL3637
SJ301 = jumper:SJ: SMD solder JUMPER
U101 U201 = custom_semiconductors:AD420
U102 U104 U106 U202 U204 U206 U304 = custom_semiconductors:AD620
U103 U203 U302 = custom_semiconductors:LP2985
U105 U205 U305 = custom_semiconductors:LTC1865
U301 = custom_semiconductors:MAX743
U303 = custom_semiconductors:LM2671
U401-U405 = custom_semiconductors:HCPL-063

## Net classes
0 default: drill 0.3 mm
1 DUT+: drill 0.3 mm, clearance 1.905 mm to class 0
2 DUT-: drill 0.3 mm, clearance 1.905 mm to class 1
3 VSENSE+: drill 0.3 mm, clearance 1.905 mm to class 0, clearance 1.905 mm to class 2
4 VSENSE-: drill 0.3 mm, clearance 1.905 mm to class 1, clearance 1.905 mm to class 3
5 default_iso: drill 0.3 mm, clearance 1.905 mm to class 0, clearance 1.905 mm to class 1, clearance 1.905 mm to class 2, clearance 1.905 mm to class 3, clearance 1.905 mm to class 4